# EAGLE design LSM6DS3_Breakout (EAGLE 7.1.0)
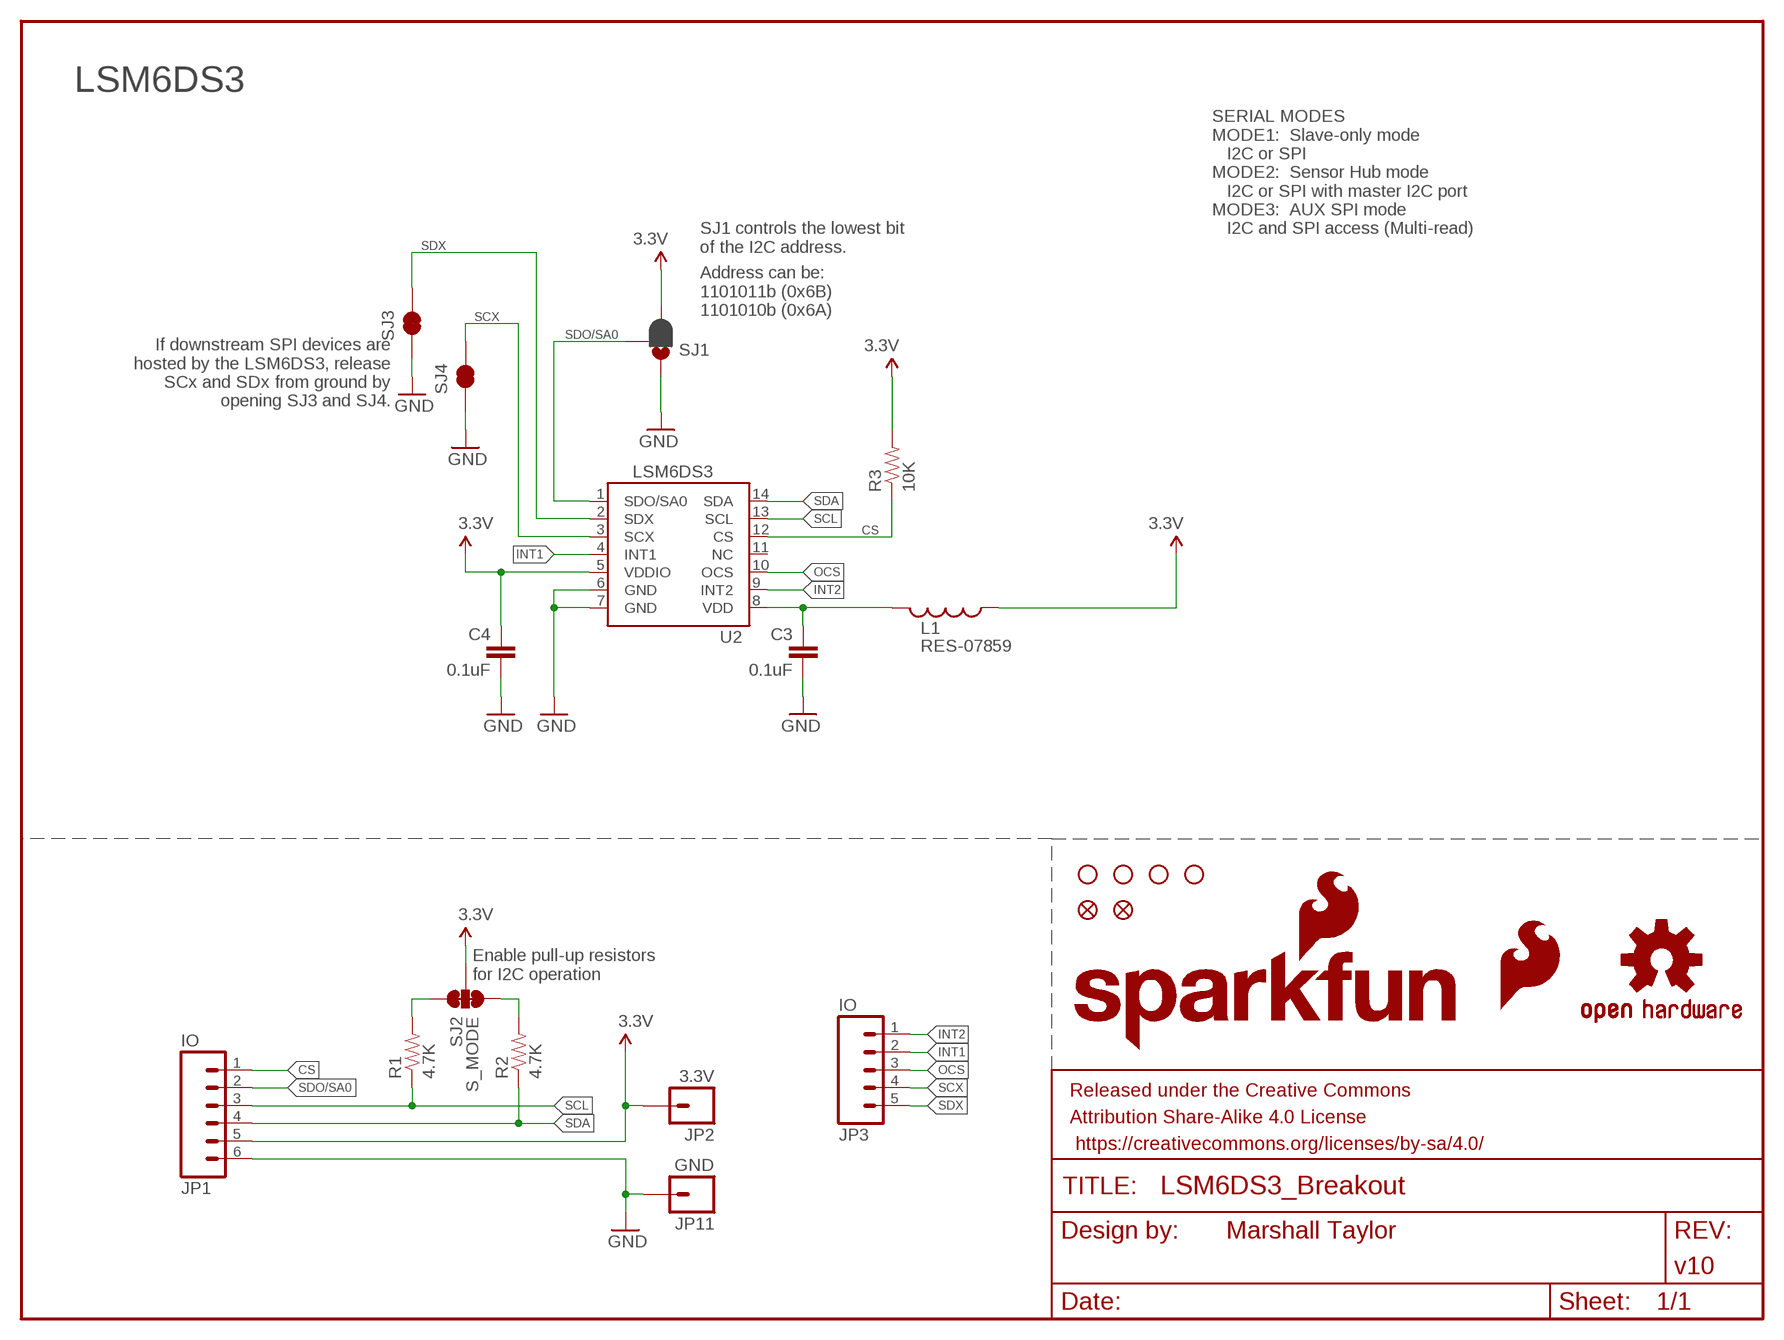
[diagram p0: schematic, sheet 1]

## Parts
C3  0.1uF  0.1UF-100V-10%(0603)  [0603-CAP]
C4  0.1uF  0.1UF-100V-10%(0603)  [0603-CAP]
FID1  FIDUCIAL1X2  [FIDUCIAL-1X2]
FID2  FIDUCIAL1X2  [FIDUCIAL-1X2]
FRAME1  FRAME-LETTER  [CREATIVE_COMMONS]
JP1  IO  M06NO_SILK_YES_STOP  [1X06_NO_SILK_YES_STOP]
JP2  3.3V  M01PTH_NO_SILK_YES_STOP  [1X01_NO_SILK]
JP3  IO  M05PTH  [1X05]
JP11  GND  M01PTH_NO_SILK_YES_STOP  [1X01_NO_SILK]
L1  RES-07859  INDUCTOR30OHM,1.8A  [0603]
LOGO1  SFE_LOGO_FLAME.2_INCH  [SFE_LOGO_FLAME_.2]
LOGO2  OSHW-LOGOS  [OSHW-LOGO-S]
LOGO3  SFE_LOGO_NAME_FLAME.1_INCH  [SFE_LOGO_NAME_FLAME_.1]
R1  4.7K  4.7KOHM-1/10W-1%(0603)  [0603-RES]
R2  4.7K  4.7KOHM-1/10W-1%(0603)  [0603-RES]
R3  10K  10KOHM-1/10W-1%(0603)0603  [0603-RES]
SJ1  JUMPER-PAD-3-2OF3_NC_BY_PASTE  [PAD-JUMPER-3-2OF3_NC_BY_PASTE_YES_SILK_FULL_BOX]
SJ2  S_MODE  JUMPER-PAD-3-NC_BY_TRACE  [PAD-JUMPER-3-3OF3_NC_BY_TRACE_YES_SILK_FULL_BOX]
SJ3  JUMPER-PAD-2-NC_BY_TRACE  [PAD-JUMPER-2-NC_BY_TRACE_YES_SILK]
SJ4  JUMPER-PAD-2-NC_BY_TRACE  [PAD-JUMPER-2-NC_BY_TRACE_YES_SILK]
STANDOFF1  STAND-OFF  [STAND-OFF]
STANDOFF2  STAND-OFF  [STAND-OFF]
STANDOFF3  STAND-OFF  [STAND-OFF]
STANDOFF4  STAND-OFF  [STAND-OFF]
U2  LSM6DS3  LSM6DS3DOT_INDICATION  [LGA14L_DOT_INDICATOR]

## Nets
3.3V: C4.1 JP1.5 JP2.1 L1.1 R3.2 SJ1.3 SJ2.2 U2.5(VDDIO)
CS: JP1.1 R3.1 U2.12(CS)
GND: C3.2 C4.2 JP1.6 JP11.1 SJ1.1 SJ3.1 SJ4.1 U2.6(GND) U2.7(GND)
INT1: JP3.2 U2.4(INT1)
INT2: JP3.1 U2.9(INT2)
N$5: R1.2 SJ2.1
N$6: R2.2 SJ2.3
OCS: JP3.3 U2.10(OCS)
SCL: JP1.3 R1.1 U2.13(SCL)
SCX: JP3.4 SJ4.2 U2.3(SCX)
SDA: JP1.4 R2.1 U2.14(SDA)
SDO/SA0: JP1.2 SJ1.2 U2.1(SDO/SA0)
SDX: JP3.5 SJ3.2 U2.2(SDX)
VDD: C3.1 L1.2 U2.8(VDD)
Unconnected: U2.11(NC)

## Notes on the sheet
- LSM6DS3
- SERIAL MODES
  MODE1:  Slave-only mode
     I2C or SPI
  MODE2:  Sensor Hub mode
     I2C or SPI with master I2C port
  MODE3:  AUX SPI mode
     I2C and SPI access (Multi-read)
- SJ1 controls the lowest bit
  of the I2C address.
- Address can be:
  1101011b (0x6B)
  1101010b (0x6A)
- If downstream SPI devices are
  hosted by the LSM6DS3, release
  SCx and SDx from ground by
  opening SJ3 and SJ4.
- Enable pull-up resistors
  for I2C operation

## Library data of the parts
C3 C4 = SparkFun-Capacitors:0.1UF-100V-10%(0603): CAP-08390; PROD_ID: CAP-08390
FID1 FID2 = SparkFun-Aesthetics:FIDUCIAL: Fiducial Alignment Points Various fiducial points for machine vision alignment.
FRAME1 = SparkFun-Aesthetics:FRAME-LETTER: Schematic Frame Standard 8.5x11 US Letter frame; DESIGNER: Marshall Taylor; VERSION: v10
JP1 = SparkFun-Connectors:M06: Header 6 Standard 6-pin 0.1" header. Use with straight break away headers (SKU : PRT-00116), right angle break away headers (PRT-00553), swiss pins (PRT-00743), machine pins (PRT-00117), and female headers (PRT-00115). Molex polarized connector foot print use with SKU : PRT-08094 with associated crimp pins and housings. NOTES ON THE VARIANTS LOCK and LOCK_LONGPADS... This footprint was designed to help hold the alignment of a through-hole component (i.e. 6-pin header) while soldering it into place. You may notice that each hole has been shifted either up or down by 0.005 of an inch from it's more standard position (which is a perfectly straight line). This slight alteration caused the pins (the squares in the middle) to touch the edges of the holes. Because they are alternating, it causes a "brace" to hold the component in place. 0.005 has proven to be the perfect amount of "off-center" position when using our standard breakaway headers. Although looks a little odd when you look at the bare footprint, once you have a header in there, the alteration is very hard to notice. Also,if you push a header all the way into place, it is covered up entirely on the bottom side. This idea of altering the position of holes to aid alignment will be further integrated into the Sparkfun Library for other footprints. It can help hold any component with 3 or more connection pins.
JP2 JP11 = SparkFun-Connectors:M01: Header 1 Standard 1-pin 0.1" header. Use with straight break away headers (SKU : PRT-00116), right angle break away headers (PRT-00553), swiss pins (PRT-00743), machine pins (PRT-00117), and female headers (PRT-00115).
JP3 = SparkFun-Connectors:M05: Header 5 Standard 5-pin 0.1" header. Use with straight break away headers (SKU : PRT-00116), right angle break away headers (PRT-00553), swiss pins (PRT-00743), machine pins (PRT-00117), and female headers (PRT-00115). Molex polarized connector foot print use with SKU : PRT-08230 with associated crimp pins and housings.
L1 = SparkFun-Passives:INDUCTOR: Inductors Basic Inductor/Choke - 0603 and 1206. Footprints are not proven and vary greatly between part numbers. SRN6045- 33uH, 20% 1.4A SDR0403-560KL - 56uH, 10%, 500mA RMS/740mA peak; PROD_ID: RES-07859
LOGO1 = SparkFun-Aesthetics:SFE_LOGO_FLAME: SFE Logo, flame only This is the SparkFun flame logo. The logo on the schematic will always be the same size; the package variant is the height of the flame. Default layer for the logo on the board is tSilk.
LOGO2 = SparkFun-Aesthetics:OSHW-LOGO: Open Source Hardware Logo This logo indicates the piece of hardware it is found on incorporates a OSHW license and/or adheres to the definition of open source hardware found here: http://freedomdefined.org/OSHW
LOGO3 = SparkFun-Aesthetics:SFE_LOGO_NAME_FLAME: SFE Logo, name and flame This is the SparkFun full logo. The logo on the schematic will always be the same size; the package variant is the height of the flame part of the logo. Default layer for the logo on the board is tSilk.
R1 R2 = SparkFun-Resistors:4.7KOHM-1/10W-1%(0603): RES-07857; PROD_ID: RES-07857
R3 = SparkFun-Resistors:10KOHM-1/10W-1%(0603): RES-00824; PROD_ID: RES-00824
SJ1 = SparkFun-Passives:JUMPER-PAD-3-2OF3_NC_BY_PASTE
SJ2 = SparkFun-Passives:JUMPER-PAD-3-NC_BY_TRACE
SJ3 SJ4 = SparkFun-Passives:JUMPER-PAD-2-NC_BY_TRACE
STANDOFF1-STANDOFF4 = SparkFun-Electromechanical:STAND-OFF: #4 Stand Off This is the mechanical footprint for a #4 phillips button head screw. Use the keepout ring to avoid running the screw head into surrounding components. SKU : PRT-00447
U2 = LSM6DS3:LSM6DS3; PROD_ID: IC-12969

## Board
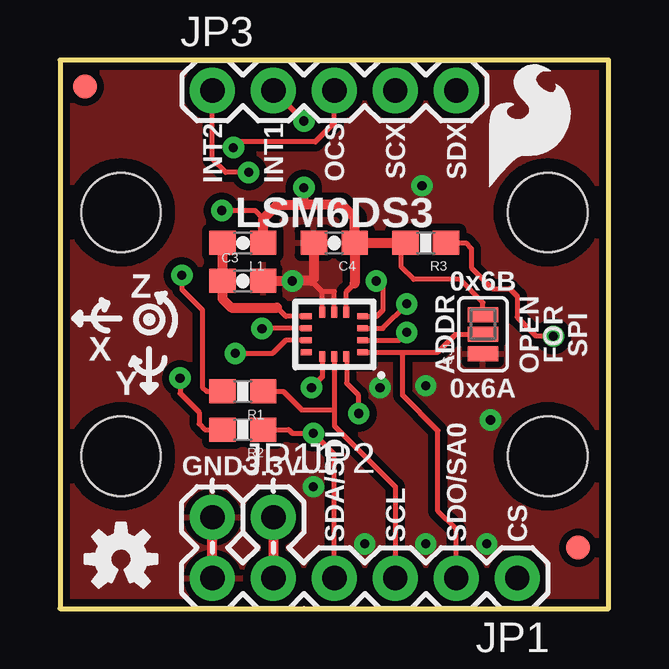
[diagram p1: board, top side]
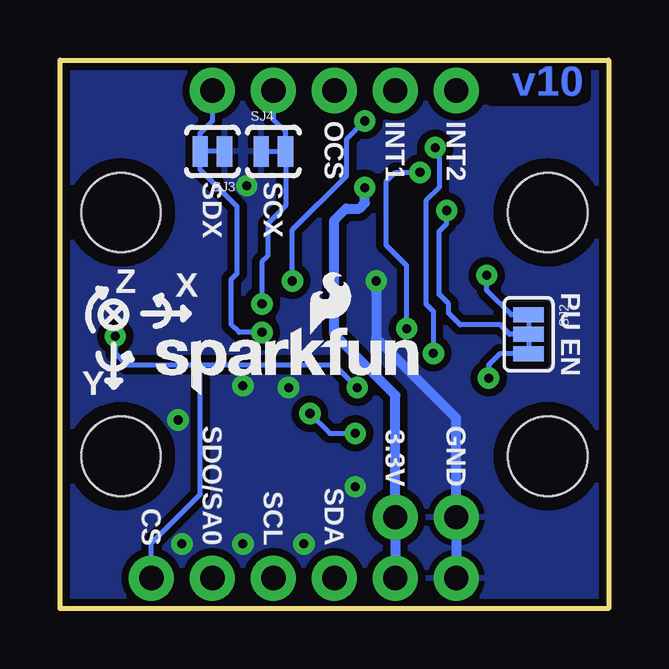
[diagram p2: board, bottom side, seen from below]

Size 22.86 x 22.86 mm. Coordinates in mm from the lower left corner, seen from the top.
Outline: 22.86,22.86 0,22.86 0,0 22.86,0 22.86,22.86
Copper layers (1*16): Top 0.035mm / dielectric 1.5mm / Bottom 0.035mm
Design rules "SparkFun-2-layer": minimum track width 7mil, minimum drill 15mil, track to track 8mil, track to pad 8mil, pad to pad 8mil, via to via 8mil, smd to smd 8mil, copper to edge 8mil, drill to drill 8mil, minimum pad ring 12mil, minimum via ring 10mil, stop-mask expansion 4mil, vias tented up to drill 20mil, thermal gap 10mil
bRestrict: 4 lines

### Footprints (pad centres in the part's own frame; a part is rotated, then mirrored left to right if it is on the bottom)
0603-CAP = smd 1.1 x 1: 1 -0.85,0; 2 0.85,0
FIDUCIAL-1X2 = smd 1 x 1: 1 0,0
1X06_NO_SILK_YES_STOP = drill 1.016 pad 1.88: 1 0,0; 2 2.54,0; 3 5.08,0; 4 7.62,0; 5 10.16,0; 6 12.7,0
1X01_NO_SILK = drill 1.016 pad 1.88: 1 0,0
1X05 = drill 1.016 pad 1.88: 1 0,0; 2 2.54,0; 3 5.08,0; 4 7.62,0; 5 10.16,0
0603 = smd 1.1 x 1: 1 -0.85,0; 2 0.85,0
0603-RES = smd 1.1 x 1: 1 -0.85,0; 2 0.85,0
PAD-JUMPER-3-2OF3_NC_BY_PASTE_YES_SILK_FULL_BOX = smd 0.635 x 1.27: 1 -0.813,0; 2 0,0; 3 0.813,0
PAD-JUMPER-3-3OF3_NC_BY_TRACE_YES_SILK_FULL_BOX = smd 0.635 x 1.27: 1 -0.813,0; 2 0,0; 3 0.813,0
PAD-JUMPER-2-NC_BY_TRACE_YES_SILK = smd 0.635 x 1.27: 1 -0.508,0; 2 0.508,0
STAND-OFF = hole 3.302: 0,0
LGA14L_DOT_INDICATOR = smd 0.45 x 0.25: 1 -1.175,0.75; 2 -1.175,0.25; 3 -1.175,-0.25; 4 -1.175,-0.75; 8 1.175,-0.75; 9 1.175,-0.25; 10 1.175,0.25; 11 1.175,0.75 | smd 0.25 x 0.45: 5 -0.5,-0.925; 6 0,-0.925; 7 0.5,-0.925; 12 0.5,0.925; 13 0,0.925; 14 -0.5,0.925

### Placement (x,y rotation side)
C3  7.62,13.65 0 top
C4  11.43,15.24 180 top
FID1  1.03,21.75 0 top
FID2  21.59,2.54 0 top
FRAME1  -19.05,-29.21 0 top  (outside the outline)
JP1  19.05,1.27 180 top
JP2  8.89,3.81 0 top
JP3  6.35,21.59 0 top
JP11  6.35,3.81 0 top
L1  7.62,15.24 180 top
LOGO1  17.54,17.3 0 top
LOGO2  2.54,2.06 0 top
LOGO3  19.29,8.81 0 bottom
R1  7.62,9.05 180 top
R2  7.62,7.46 180 top
R3  15.24,15.24 180 top
SJ1  17.62,11.43 90 top
SJ2  3.33,11.43 270 bottom
SJ3  16.51,19.05 180 bottom
SJ4  13.97,19.05 0 bottom
STANDOFF1  2.54,16.51 0 top
STANDOFF2  2.54,6.35 0 top
STANDOFF3  20.32,16.51 0 top
STANDOFF4  20.32,6.35 0 top
U2  11.43,11.43 180 top

### Tracks (layer width: path | path; a pad name or v marks a point on that pad's centre or on a via)
3.3V  (via drill 0.38)
  Top 0.203: U2.5 11.93,13.2 12.28,13.55 | R3.2 14.22,15.07 14.22,14.22 14.73,13.72 16.67,13.72 17.62,12.76 SJ1.3 | v6.75,16.59 8.13,16.59 8.47,16.25
  Top 0.406: C4.1 R3.2 | JP2.1 JP1.5 | C4.1 12.28,16.3 11.75,16.83 10.16,16.83 10.16,16.91 | 10.16,16.91 v10.16,17.54 | C4.1 12.28,13.55 | L1.1 8.47,16.25 9.05,16.83 10.08,16.83 10.16,16.91
  Bottom 0.203: SJ2.2 4.13,11.43 4.52,11.83 6.19,11.83 6.67,12.3 6.67,12.7 7.06,13.1 7.06,15.72 6.75,16.03 v6.75,16.59
  Bottom 0.406: JP1.5 JP2.1 8.89,8.89 11.43,11.43 11.43,16.19 10.95,16.67 10.4,16.67 10.16,16.91 v10.16,17.54
CS  (via drill 0.38 pad 0.25)
  Top 0.203: U2.12 10.93,9.66 v10.48,9.21 | R3.1 16.91,15.24 17.14,15 17.14,14.21 18.02,13.34 18.73,13.34 19.05,13.02 19.05,12.14 19.84,11.35 v20.56,11.35
  Bottom 0.203: 17.02,10.16 20.08,10.16 20.56,10.64 v20.56,11.35 | 17.02,10.16 11.43,10.16 v10.48,9.21 | JP1.1 19.05,2.73 17.02,4.76 17.02,10.16
GND  (via drill 0.38)
  Top 0.203: U2.6 11.43,13.21 10.92,13.21 | C4.2 10.58,13.55 10.92,13.21 | U2.7 10.93,13.2 10.92,13.21
  Top 0.406: JP1.6 JP11.1 | C3.2 v9.68,13.65 10.48,13.65 10.58,13.76 C4.2
  Bottom 0.406: JP1.6 JP11.1 6.35,7.94 9.68,11.27 v9.68,13.65
  other vias: 15.08,17.62 17.94,7.86 15.24,9.29 13.34,9.21 15.24,2.7 17.78,2.7 10.56,5.08 12.7,2.7
  pour Bottom (isolate 0.305): 22.86,0 22.86,22.86 0,22.86 0,0
  pour Top (isolate 0.305): 22.86,0 22.86,22.86 0,22.86 0,0
INT1  (via drill 0.38, 0.38 pad 0.25)
  Top 0.203: U2.4 13.2,12.18 13.46,12.45 13.46,13.37 v13.18,13.65 | v10.16,20.32 JP3.2
  Bottom 0.203: v13.18,13.65 13.18,15.78 10.92,18.03 10.92,19.56 v10.16,20.32
INT2  (via drill 0.38)
  Top 0.203: U2.9 v8.4,11.68 v8.41,11.67 | v7.86,18.18 6.91,18.18 6.35,18.73 JP3.1
  Bottom 0.203: v8.41,11.67 8.41,14.29 9.29,15.16 9.29,17.78 8.89,18.18 v7.86,18.18
N$5  (via drill 0.38)
  Top 0.203: R1.2 6.11,9.05 5.94,9.22 5.94,12.45 5.08,13.3 v5.08,13.89
  Bottom 0.203: SJ2.1 4.07,12.24 5.08,13.26 v5.08,13.89
N$6  (via drill 0.38)
  Top 0.203: v5,9.6 5,8.97 5.79,8.18 5.79,7.7 6.03,7.46 R2.2
  Bottom 0.203: SJ2.3 4.54,10.62 5,10.16 v5,9.6
OCS  (via drill 0.38, 0.38 pad 0.25)
  Top 0.203: U2.10 9.4,11.18 8.86,10.64 v7.3,10.64 | JP3.3 11.43,20.24 10.64,19.45 7.46,19.45 v7.22,19.21
  Bottom 0.203: v7.3,10.64 7.3,12.38 7.62,12.7 7.62,16.99 7.06,17.54 7.06,18.81 7.22,18.97 v7.22,19.21
SCL
  Top 0.203: U2.13 11.43,8.29 | 11.43,8.29 11.43,7.62 13.97,5.08 JP1.3 | 11.43,8.29 10.06,8.29 9.3,9.05 R1.1
SCX  (via drill 0.38 pad 0.25)
  Top 0.203: U2.3 13.46,11.68 14.45,12.67 v14.45,12.7
  Bottom 0.203: v14.45,12.7 14.45,14.45 14.21,14.68 14.21,16.03 13.46,16.78 SJ4.2 13.46,19.89 13.97,20.4 JP3.4
SDA  (via drill 0.38)
  Top 0.203: U2.14 11.94,9.4 12.45,8.89 v12.45,8.13 | JP1.4 11.43,6.43 v10.56,7.3 9.68,7.3 9.53,7.46 R2.1
  Bottom 0.203: v12.45,8.13 11.62,7.3 v10.56,7.3
SDO/SA0
  Top 0.203: JP1.2 16.51,3.3 15.75,4.06 15.75,7.41 14.27,8.89 14.27,10.68 | SJ1.2 16.49,11.43 15.74,10.68 14.27,10.68 | U2.1 14.27,10.68
SDX  (via drill 0.38 pad 0.25)
  Top 0.203: U2.2 14.12,11.18 v14.45,11.51
  Bottom 0.203: v14.45,11.51 15.4,11.51 15.72,11.83 15.72,13.73 15.48,13.97 15.48,16.75 17.02,18.29 SJ3.2 17.02,19.81 16.51,20.32 JP3.5
VDD
  Top 0.203: U2.8 9.41,12.18 9.05,12.54
  Top 0.406: L1.2 C3.1 6.77,12.91 7.14,12.54 9.05,12.54

### Text on the board
Bottom: v10
tPlace: INT2 | INT1 | OCS | SCX | SDX | LSM6DS3 | Z | 0x6B | ADDR | OPEN / FOR / SPI | X | 0x6A | Y | GND | 3.3V | SDA/SDI | SCL | SDO/SA0 | CS
bPlace: INT2 | INT1 | OCS | SCX | SDX | X | Z | PU EN | Y | GND | 3.3V | SDA | SCL | SDO/SA0 | CS
Measures: Units in Inches